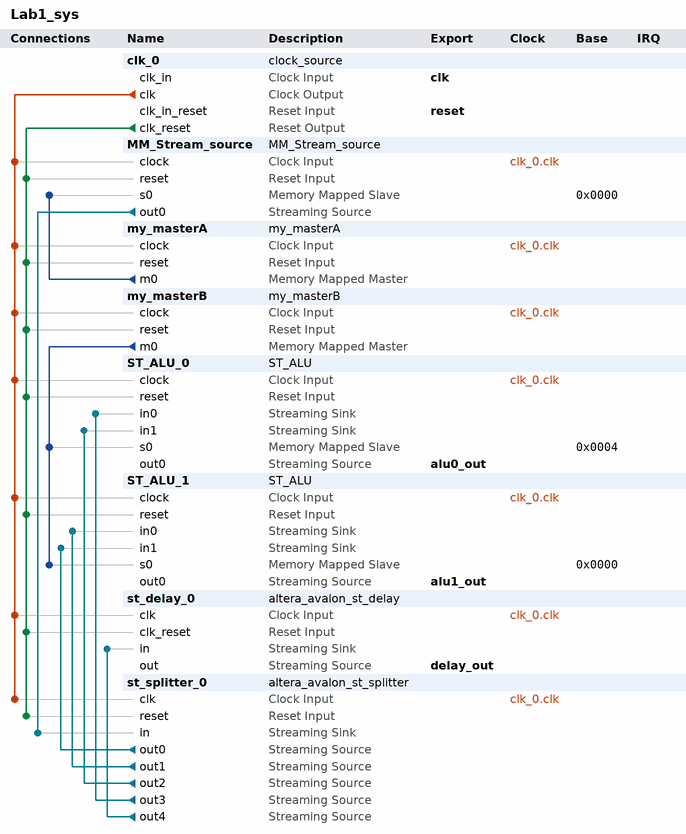
[diagram p0: system contents]
# Platform Designer (Qsys) system Lab1_sys, Cyclone IV E EP4CE6E22C8
# Parameters at their usual value, and those the tool derives, are not listed.
package require -exact qsys 16.1
create_system Lab1_sys
set_project_property DEVICE_FAMILY {Cyclone IV E}
set_project_property DEVICE EP4CE6E22C8

add_instance clk_0 clock_source 16.1
set_instance_parameter_value clk_0 clockFrequency 50000000
set_instance_parameter_value clk_0 resetSynchronousEdges DEASSERT

add_instance MM_Stream_source MM_Stream_source 1.0

add_instance my_masterA my_masterA 1.0
set_instance_parameter_value my_masterA address 0
set_instance_parameter_value my_masterA data 100

add_instance my_masterB my_masterB 1.0
set_instance_parameter_value my_masterB address_1 0
set_instance_parameter_value my_masterB address_2 4
set_instance_parameter_value my_masterB data_1 111
set_instance_parameter_value my_masterB data_2 222

add_instance ST_ALU_0 ST_ALU 1.0

add_instance ST_ALU_1 ST_ALU 1.0

add_instance st_delay_0 altera_avalon_st_delay 16.1
set_instance_parameter_value st_delay_0 BITS_PER_SYMBOL 8
set_instance_parameter_value st_delay_0 CHANNEL_WIDTH 1
set_instance_parameter_value st_delay_0 DATA_WIDTH 32
set_instance_parameter_value st_delay_0 ERROR_WIDTH 1
set_instance_parameter_value st_delay_0 MAX_CHANNELS 1
set_instance_parameter_value st_delay_0 NUMBER_OF_DELAY_CLOCKS 1
set_instance_parameter_value st_delay_0 USE_CHANNEL 0
set_instance_parameter_value st_delay_0 USE_ERROR 0
set_instance_parameter_value st_delay_0 USE_PACKETS 0

add_instance st_splitter_0 altera_avalon_st_splitter 16.1
set_instance_parameter_value st_splitter_0 BITS_PER_SYMBOL 8
set_instance_parameter_value st_splitter_0 CHANNEL_WIDTH 1
set_instance_parameter_value st_splitter_0 DATA_WIDTH 32
set_instance_parameter_value st_splitter_0 ERROR_WIDTH 1
set_instance_parameter_value st_splitter_0 MAX_CHANNELS 1
set_instance_parameter_value st_splitter_0 NUMBER_OF_OUTPUTS 5
set_instance_parameter_value st_splitter_0 QUALIFY_VALID_OUT 1
set_instance_parameter_value st_splitter_0 READY_LATENCY 0
set_instance_parameter_value st_splitter_0 USE_CHANNEL 0
set_instance_parameter_value st_splitter_0 USE_DATA 1
set_instance_parameter_value st_splitter_0 USE_ERROR 0
set_instance_parameter_value st_splitter_0 USE_PACKETS 0
set_instance_parameter_value st_splitter_0 USE_READY 1
set_instance_parameter_value st_splitter_0 USE_VALID 1

# connections
add_connection clk_0.clk MM_Stream_source.clock clock
add_connection clk_0.clk my_masterA.clock clock
add_connection clk_0.clk my_masterB.clock clock
add_connection clk_0.clk ST_ALU_0.clock clock
add_connection clk_0.clk ST_ALU_1.clock clock
add_connection clk_0.clk st_delay_0.clk clock
add_connection clk_0.clk st_splitter_0.clk clock
add_connection clk_0.clk_reset MM_Stream_source.reset reset
add_connection clk_0.clk_reset my_masterA.reset reset
add_connection clk_0.clk_reset my_masterB.reset reset
add_connection clk_0.clk_reset ST_ALU_0.reset reset
add_connection clk_0.clk_reset ST_ALU_1.reset reset
add_connection clk_0.clk_reset st_delay_0.clk_reset reset
add_connection clk_0.clk_reset st_splitter_0.reset reset
add_connection my_masterA.m0 MM_Stream_source.s0 avalon
set_connection_parameter_value my_masterA.m0/MM_Stream_source.s0 baseAddress 0x0000
add_connection my_masterB.m0 ST_ALU_0.s0 avalon
set_connection_parameter_value my_masterB.m0/ST_ALU_0.s0 baseAddress 0x0004
add_connection my_masterB.m0 ST_ALU_1.s0 avalon
set_connection_parameter_value my_masterB.m0/ST_ALU_1.s0 baseAddress 0x0000
add_connection MM_Stream_source.out0 st_splitter_0.in avalon_streaming
add_connection st_splitter_0.out0 ST_ALU_1.in1 avalon_streaming
add_connection st_splitter_0.out1 ST_ALU_1.in0 avalon_streaming
add_connection st_splitter_0.out2 ST_ALU_0.in1 avalon_streaming
add_connection st_splitter_0.out3 ST_ALU_0.in0 avalon_streaming
add_connection st_splitter_0.out4 st_delay_0.in avalon_streaming

# exported interfaces
add_interface alu0_out avalon_streaming source
set_interface_property alu0_out EXPORT_OF ST_ALU_0.out0
add_interface alu1_out avalon_streaming source
set_interface_property alu1_out EXPORT_OF ST_ALU_1.out0
add_interface clk clock sink
set_interface_property clk EXPORT_OF clk_0.clk_in
add_interface delay_out avalon_streaming source
set_interface_property delay_out EXPORT_OF st_delay_0.out
add_interface reset reset sink
set_interface_property reset EXPORT_OF clk_0.clk_in_reset

set_interconnect_requirement {$system} qsys_mm.clockCrossingAdapter HANDSHAKE
set_interconnect_requirement {$system} qsys_mm.enableEccProtection FALSE
set_interconnect_requirement {$system} qsys_mm.insertDefaultSlave FALSE
set_interconnect_requirement {$system} qsys_mm.maxAdditionalLatency 1

save_system Lab1_sys.qsys
